# EAGLE schematic Wireless+controller (EAGLE 9.7.0)
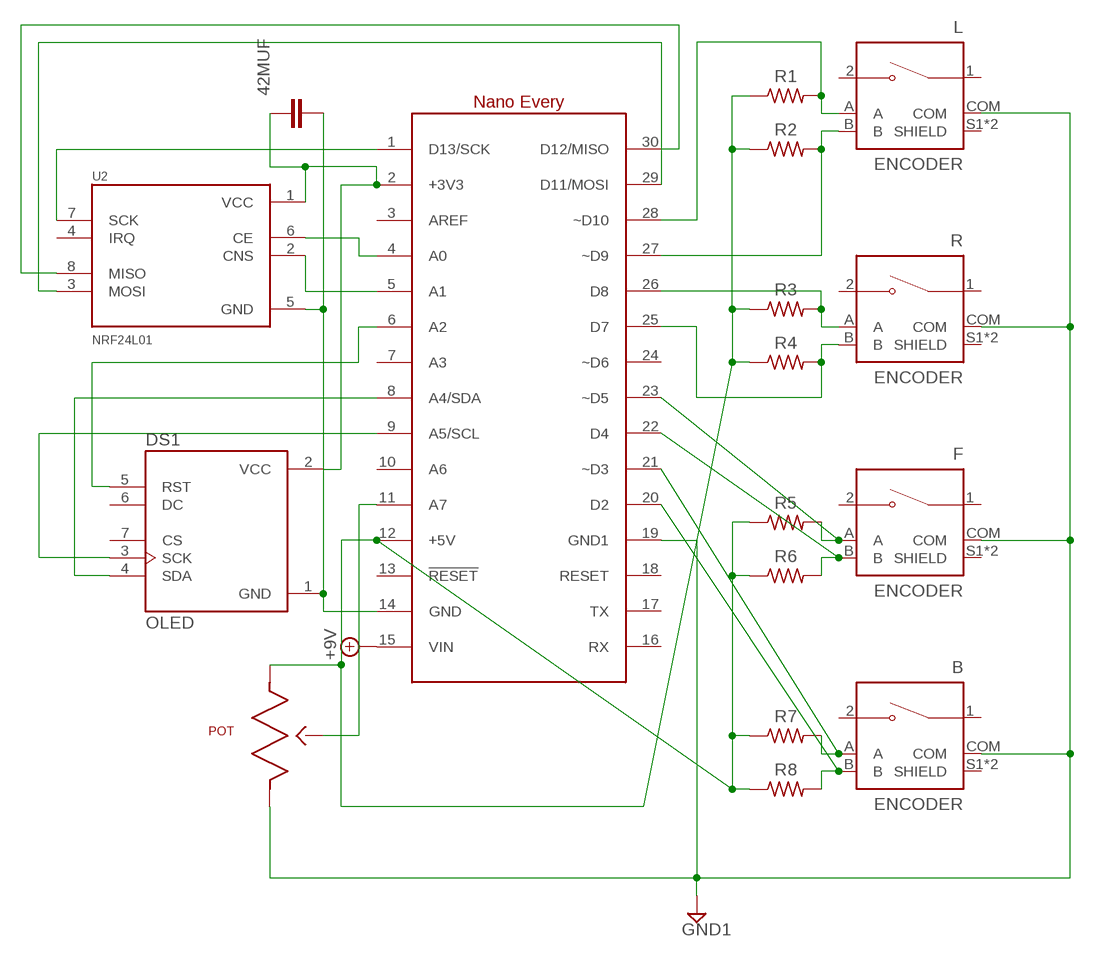
[diagram p0: schematic, sheet 1]

## Parts
42MUF  C_RADIAL-12.5MM-DIA  [CAPRD550W60D1025H1250B]
B  ENCODER  [XDCR_PEC11R-4215F-S0024]
DS1  OLED  [OLED]
F  ENCODER  [XDCR_PEC11R-4215F-S0024]
L  ENCODER  [XDCR_PEC11R-4215F-S0024]
POT  POTENTIOMETER  [P160]
R  ENCODER  [XDCR_PEC11R-4215F-S0024]
R1  R-US_AXIAL-7.2MM-PITCH  [RESAD724W46L381D178B]
R2  R-US_AXIAL-7.2MM-PITCH  [RESAD724W46L381D178B]
R3  R-US_AXIAL-7.2MM-PITCH  [RESAD724W46L381D178B]
R4  R-US_AXIAL-7.2MM-PITCH  [RESAD724W46L381D178B]
R5  R-US_AXIAL-7.2MM-PITCH  [RESAD724W46L381D178B]
R6  R-US_AXIAL-7.2MM-PITCH  [RESAD724W46L381D178B]
R7  R-US_AXIAL-7.2MM-PITCH  [RESAD724W46L381D178B]
R8  R-US_AXIAL-7.2MM-PITCH  [RESAD724W46L381D178B]
U1  ARDUINONANO  [NANO]
U2  NRF24L01  [NRF24L01]

## Nets
+9V: U1.15(VIN)
GND1: B.COM F.COM L.COM POT.3 R.COM U1.19(GND1)
N$1: L.A R1.2 U1.28(~D10)
N$2: L.B R2.2 U1.27(~D9)
N$3: R3.2 R.A U1.26(D8)
N$4: R4.2 R.B U1.25(D7)
N$5: F.A R5.2 U1.23(~D5)
N$6: U1.4(A0) U2.6(CE)
N$7: F.B R6.2 U1.22(D4)
N$8: U1.5(A1) U2.2(CNS)
N$9: B.A R7.2 U1.21(~D3)
N$10: B.B R8.2 U1.20(D2)
N$13: U1.30(D12/MISO) U2.8(MISO)
N$14: U1.29(D11/MOSI) U2.3(MOSI)
N$15: POT.2 U1.11(A7)
N$16: DS1.3(SCK) U1.9(A5/SCL)
N$17: DS1.4(SDA) U1.8(A4/SDA)
N$18: 42MUF.1 DS1.2(VCC) U1.2(+3V3) U2.1(VCC)
N$19: 42MUF.2 DS1.1(GND) U1.14(GND) U2.5(GND)
N$20: U1.1(D13/SCK) U2.7(SCK)
N$21: DS1.5(RST) U1.6(A2)
N$25: POT.1 R1.1 R2.1 R3.1 R4.1 R5.1 R6.1 R7.1 R8.1 U1.12(+5V)
Unconnected: B.1 B.2 B.S1(SHIELD) B.S2(SHIELD) DS1.6(DC) DS1.7(CS) F.1 F.2 F.S1(SHIELD) F.S2(SHIELD) L.1 L.2 L.S1(SHIELD) L.S2(SHIELD) R.1 R.2 R.S1(SHIELD) R.S2(SHIELD) U1.3(AREF) U1.7(A3) U1.10(A6) U1.13(!RESET) U1.16(RX) U1.17(TX) U1.18(RESET) U1.24(~D6) U2.4(IRQ)

## Library data of the parts
42MUF = Capacitor:C: Capacitor - Generic; CATEGORY: Capacitor
B F L R = rotary encoder:ENCODER: Incremental Encoder, 12 Mm, Contact Rating 10 Ma - 5 Vdc; MANUFACTURER: J.W.Miller/Bourns; MAXIMUM_PACKAGE_HEIGHT: 21.5 mm; PARTREV: Rev. 09/19; STANDARD: Manufacturer Recommendations
DS1 = OLED:OLED: Non-Touch Graphic LCD Display Module - White OLED SPI 1.54in (39.12mm) 128 x 64; MANUFACTURER: Orient Display; MAXIMUM_PACKAGE_HEIGHT: 5.5mm; PARTREV: O; STANDARD: Manufacturer Recommendations
POT = potentiometer:POTENTIOMETER: 500k Ohm 1 Gang Linear Panel Mount Potentiometer None 1 Turn Conductive Plastic 0.2W, 1/5W PC Pins; PARTNO: 987-1304-ND
R1-R8 = Resistor:R-US: Resistor Fixed - ANSI; CATEGORY: Resistor; SUB-CATEGORY: Fixed
U1 = Arduino Nano:ARDUINONANO: ATmega4809 Arduino Nano Every AVR AVR MCU 8-Bit Embedded Evaluation Board; MANUFACTURER: Arduino; PARTREV: 6-11-19; STANDARD: Manufacturer Recommendations
U2 = nRF24L01:NRF24L01: MakerFocus 4pcs ESP8266 ESP-01 Serial Wireless WiFi Transceiver Receiver Module 1MB SPI Flash DC3.0-3.6V Internet of Things WiFi Module Board Compatible with Ar duino; MANUFACTURER: AI-Thinker; MAXIMUM_PACKAGE_HEIGHT: 11.2 mm; PARTREV: V1.2; STANDARD: Manufacturer recommendations or IPC 7351B